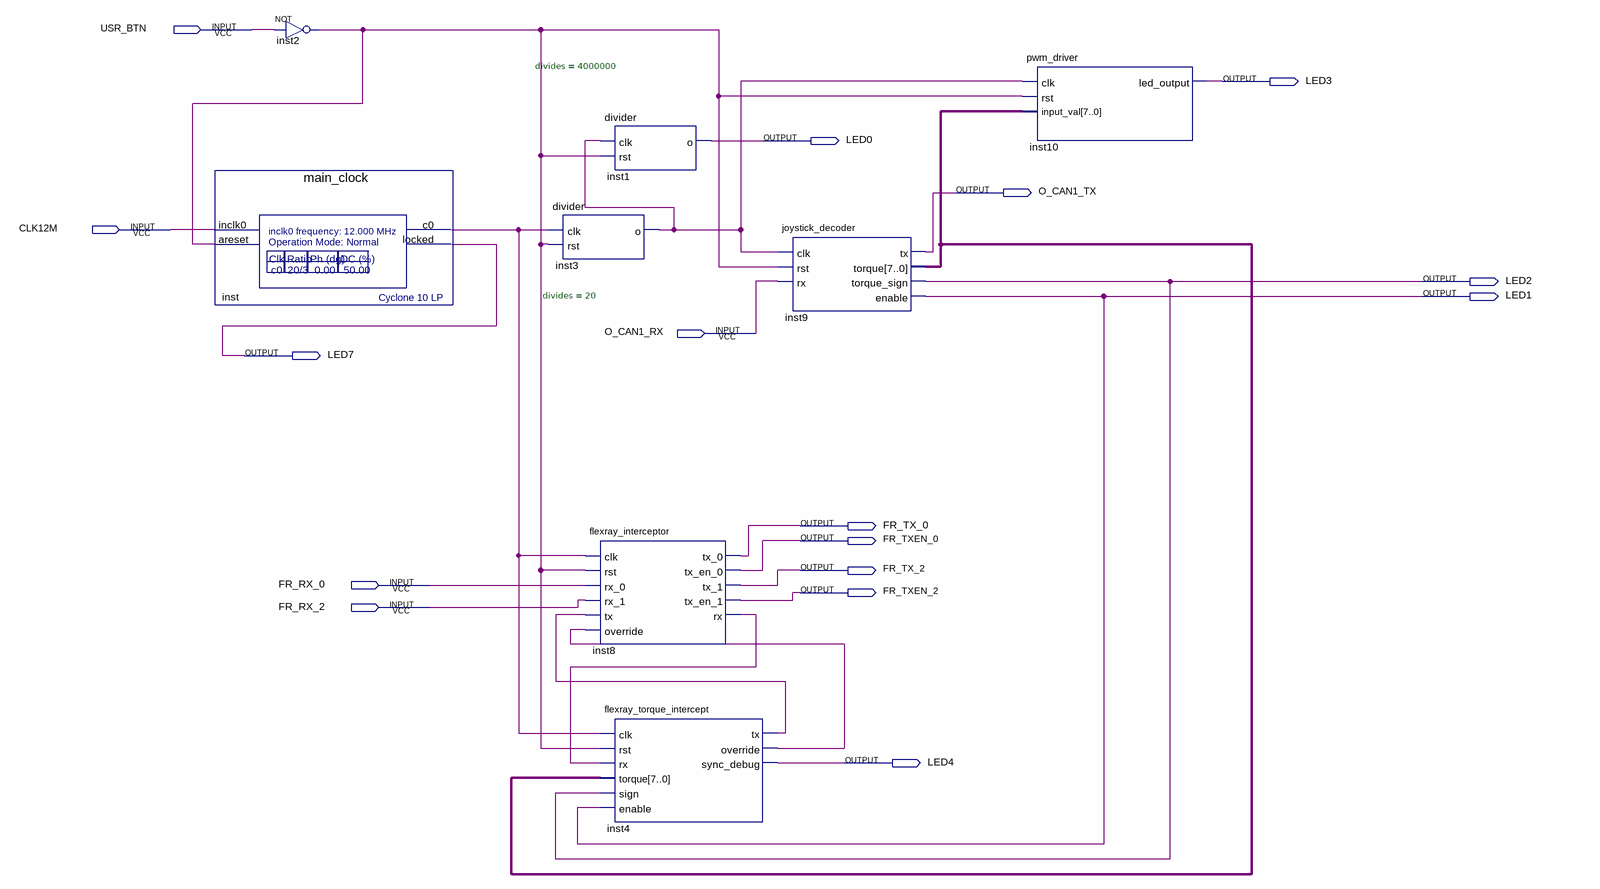
[diagram p0: schematic sheet]
// Quartus schematic bendbeam.bdf as structural Verilog: 8 symbols, 16 pins
module bendbeam (
  input  USR_BTN,
  input  CLK12M,
  input  O_CAN1_RX,
  input  FR_RX_0,
  input  FR_RX_2,
  output LED3,
  output LED0,
  output O_CAN1_TX,
  output LED2,
  output LED1,
  output LED7,
  output FR_TX_0,
  output FR_TXEN_0,
  output FR_TX_2,
  output FR_TXEN_2,
  output LED4
);

  wire inst2_out, inst3_o, inst4_override, inst4_tx, inst8_rx, inst_c0;
  wire [7:0] inst9_torque;

  main_clock inst (.inclk0(CLK12M), .areset(inst2_out), .c0(inst_c0), .locked(LED7));
  not inst2 (inst2_out, USR_BTN);
  divider #(.divides(20)) inst3 (.clk(inst_c0), .rst(inst2_out), .o(inst3_o));
  divider #(.divides(4000000)) inst1 (.clk(inst3_o), .rst(inst2_out), .o(LED0));
  flexray_interceptor inst8 (
    .clk(inst_c0), .rst(inst2_out), .rx_0(FR_RX_0), .rx_1(FR_RX_2), .tx(inst4_tx), .override(inst4_override),
    .tx_0(FR_TX_0), .tx_en_0(FR_TXEN_0), .tx_1(FR_TX_2), .tx_en_1(FR_TXEN_2), .rx(inst8_rx));
  flexray_torque_intercept inst4 (
    .clk(inst_c0), .rst(inst2_out), .rx(inst8_rx), .torque(inst9_torque), .sign(LED2), .enable(LED1),
    .tx(inst4_tx), .override(inst4_override), .sync_debug(LED4));
  joystick_decoder inst9 (
    .clk(inst3_o), .rst(inst2_out), .rx(O_CAN1_RX), .tx(O_CAN1_TX), .torque(inst9_torque),
    .torque_sign(LED2), .enable(LED1));
  pwm_driver inst10 (.clk(inst3_o), .rst(inst2_out), .input_val(inst9_torque), .led_output(LED3));
endmodule
